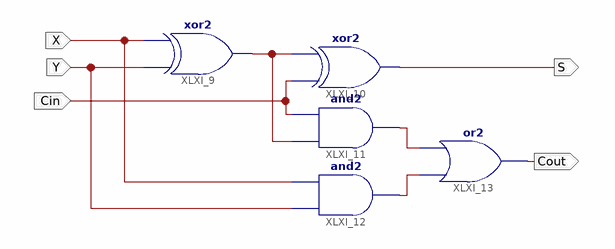
[diagram p0: schematic sheet 1]
// Xilinx ISE schematic CLC.sch (spartan6) as structural Verilog: 5 symbols, 5 ports
module CLC (
  input  Cin,
  input  X,
  input  Y,
  output S,
  output Cout
);

  wire XLXN_15, XLXN_16, XLXN_26;

  xor XLXI_9 (XLXN_26, Y, X);
  xor XLXI_10 (S, Cin, XLXN_26);
  and XLXI_11 (XLXN_15, XLXN_26, Cin);
  and XLXI_12 (XLXN_16, Y, X);
  or XLXI_13 (Cout, XLXN_16, XLXN_15);
endmodule
